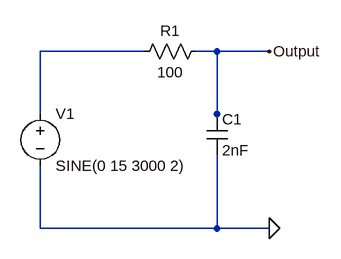
[diagram p0: schematic rc_integrator.asc]
rc_integrator.asc, the LTspice schematic file:
Version 4
SHEET 1 880 680
WIRE 352 160 192 160
WIRE 464 160 432 160
WIRE 544 160 464 160
WIRE 192 256 192 160
WIRE 464 256 464 160
WIRE 464 272 464 256
WIRE 192 432 192 336
WIRE 464 432 464 320
WIRE 464 432 192 432
WIRE 544 432 464 432
FLAG 544 160 Output
FLAG 544 432 0
SYMBOL voltage 192 240 R0
SYMATTR InstName V1
SYMATTR Value SINE(0 15 3000 2)
SYMBOL res 448 144 R90
WINDOW 0 0 56 VBottom 2
WINDOW 3 32 56 VTop 2
SYMATTR InstName R1
SYMATTR Value 100
SYMBOL cap 448 256 R0
SYMATTR InstName C1
SYMATTR Value 2nF

The netlist it stands for:
* rc_integrator.asc
V1 N001 0 SINE(0 15 3000 2)
R1 Output N001 100
C1 Output 0 2nF
.backanno
.end